# EAGLE design PiHatTeensy32 (EAGLE 9.6.0)
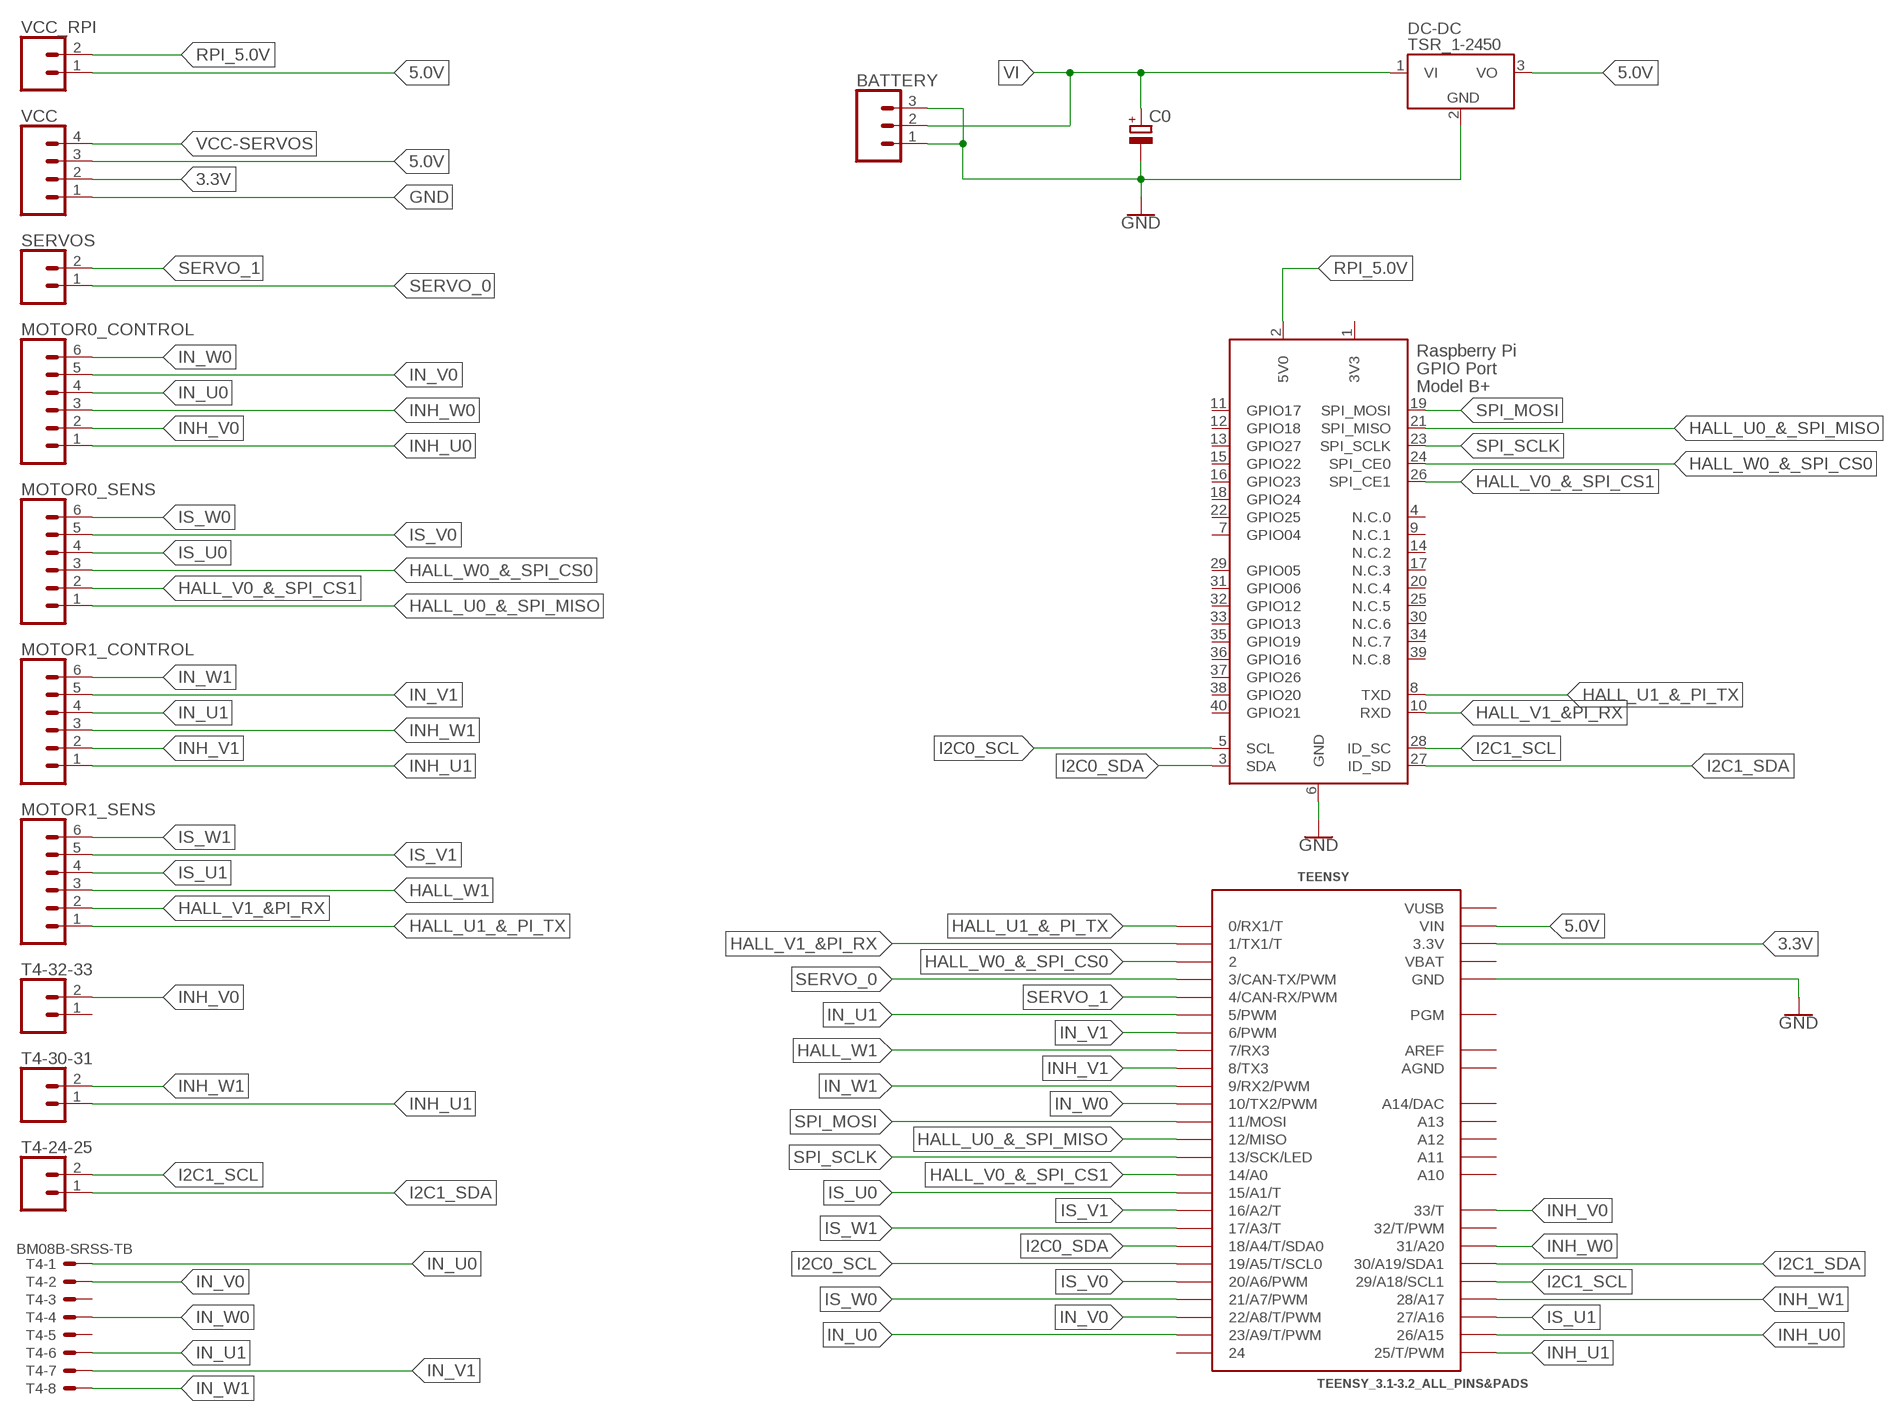
[diagram p0: schematic, sheet 1]

## Parts
BATTERY  CONN_031X03_NO_SILK  [1X03_NO_SILK]
C0  CPOL-EUE2,5-6E  [E2,5-6E]
DC-DC  TSR_1-2450  [TSR-1]
MOTOR0_CONTROL  CONN_06NO_SILK_NO_POP  [1X06_NO_SILK]
MOTOR0_SENS  CONN_06NO_SILK_NO_POP  [1X06_NO_SILK]
MOTOR1_CONTROL  CONN_06NO_SILK_NO_POP  [1X06_NO_SILK]
MOTOR1_SENS  CONN_06NO_SILK_NO_POP  [1X06_NO_SILK]
SERVOS  CONN_021X02_NO_SILK  [1X02_NO_SILK]
T4  BM08B-SRSS-TB  [BM08B-SRSS-TB]
T4-24-25  CONN_021X02_NO_SILK  [1X02_NO_SILK]
T4-30-31  CONN_021X02_NO_SILK  [1X02_NO_SILK]
T4-32-33  CONN_021X02_NO_SILK  [1X02_NO_SILK]
TEENSY  TEENSY_3.1-3.2_ALL_PINS&PADS  [TEENSY_3.0-3.2_ALL_PINS_&_PADS]
VCC  CONN_041X04_NO_SILK  [1X04_NO_SILK]
VCC_RPI  CONN_021X02_NO_SILK  [1X02_NO_SILK]
X1  RASPI_BOARD_B+_H  [RASPI_BOARD_B+HAT]

## Nets
3.3V: TEENSY.3.3V TEENSY.3.3V1(3.3V) TEENSY.3.3V2(3.3V) VCC.2
5.0V: DC-DC.3(VO) TEENSY.VIN VCC.3 VCC_RPI.1
GND: BATTERY.1 BATTERY.3 C0.- DC-DC.2(GND) TEENSY.GND TEENSY.GND1(GND) TEENSY.GND2(GND) VCC.1 X1.6(GND)
HALL_U0_&_SPI_MISO: MOTOR0_SENS.1 TEENSY.12(12/MISO) X1.21(SPI_MISO)
HALL_U1_&_PI_TX: MOTOR1_SENS.1 TEENSY.0(0/RX1/T) X1.8(TXD)
HALL_V0_&_SPI_CS1: MOTOR0_SENS.2 TEENSY.14/A0 X1.26(SPI_CE1)
HALL_V1_&PI_RX: MOTOR1_SENS.2 TEENSY.1(1/TX1/T) X1.10(RXD)
HALL_W0_&_SPI_CS0: MOTOR0_SENS.3 TEENSY.2 X1.24(SPI_CE0)
HALL_W1: MOTOR1_SENS.3 TEENSY.7(7/RX3)
I2C0_SCL: TEENSY.19/A5(19/A5/T/SCL0) X1.5(SCL)
I2C0_SDA: TEENSY.18/A4(18/A4/T/SDA0) X1.3(SDA)
I2C1_SCL: T4-24-25.2 TEENSY.29(29/A18/SCL1) X1.28(ID_SC)
I2C1_SDA: T4-24-25.1 TEENSY.30(30/A19/SDA1) X1.27(ID_SD)
IN_U0: MOTOR0_CONTROL.4 T4.1 TEENSY.23/A9(23/A9/T/PWM)
IN_U1: MOTOR1_CONTROL.4 T4.6 TEENSY.5(5/PWM)
IN_V0: MOTOR0_CONTROL.5 T4.2 TEENSY.22/A8(22/A8/T/PWM)
IN_V1: MOTOR1_CONTROL.5 T4.7 TEENSY.6(6/PWM)
IN_W0: MOTOR0_CONTROL.6 T4.4 TEENSY.10(10/TX2/PWM)
IN_W1: MOTOR1_CONTROL.6 T4.8 TEENSY.9(9/RX2/PWM)
INH_U0: MOTOR0_CONTROL.1 TEENSY.26(26/A15)
INH_U1: MOTOR1_CONTROL.1 T4-30-31.1 TEENSY.25(25/T/PWM)
INH_V0: MOTOR0_CONTROL.2 T4-32-33.2 TEENSY.33(33/T)
INH_V1: MOTOR1_CONTROL.2 TEENSY.8(8/TX3)
INH_W0: MOTOR0_CONTROL.3 TEENSY.31(31/A20)
INH_W1: MOTOR1_CONTROL.3 T4-30-31.2 TEENSY.28(28/A17)
IS_U0: MOTOR0_SENS.4 TEENSY.15/A1(15/A1/T)
IS_U1: MOTOR1_SENS.4 TEENSY.27(27/A16)
IS_V0: MOTOR0_SENS.5 TEENSY.20/A6(20/A6/PWM)
IS_V1: MOTOR1_SENS.5 TEENSY.16/A2(16/A2/T)
IS_W0: MOTOR0_SENS.6 TEENSY.21/A7(21/A7/PWM)
IS_W1: MOTOR1_SENS.6 TEENSY.17/A3(17/A3/T)
RPI_5.0V: VCC_RPI.2 X1.2(5V0)
SERVO_0: SERVOS.1 TEENSY.3(3/CAN-TX/PWM)
SERVO_1: SERVOS.2 TEENSY.4(4/CAN-RX/PWM)
SPI_MOSI: TEENSY.11(11/MOSI) X1.19(SPI_MOSI)
SPI_SCLK: TEENSY.13(13/SCK/LED) X1.23(SPI_SCLK)
VCC-SERVOS: VCC.4
VI: BATTERY.2 C0.+ DC-DC.1(VI)
Unconnected: T4-32-33.1 T4.3 T4.5 TEENSY.24 TEENSY.32(32/T/PWM) TEENSY.A10 TEENSY.A11 TEENSY.A12 TEENSY.A13 TEENSY.PGM TEENSY.RESET/DAC(A14/DAC) X1.4(N.C.0) X1.7(GPIO04) X1.9(N.C.1) X1.11(GPIO17) X1.12(GPIO18) X1.13(GPIO27) X1.14(N.C.2) X1.15(GPIO22) X1.16(GPIO23) X1.17(N.C.3) X1.18(GPIO24) X1.20(N.C.4) X1.22(GPIO25) X1.25(N.C.5) X1.29(GPIO05) X1.30(N.C.6) X1.31(GPIO06) X1.32(GPIO12) X1.33(GPIO13) X1.34(N.C.7) X1.35(GPIO19) X1.36(GPIO16) X1.37(GPIO26) X1.38(GPIO20) X1.39(N.C.8) X1.40(GPIO21)

## Power pins joined to a net without a drawn wire
3V3: X1.1(3V3)
AGND: TEENSY.AGND
AREF: TEENSY.AREF
VBAT: TEENSY.VBAT
VUSB: TEENSY.VUSB

## Library data of the parts
BATTERY = SparkFun-Connectors:CONN_03: Multi connection point. Often used as Generic Header-pin footprint for 0.1 inch spaced/style header connections On any of the 0.1 inch spaced packages, you can populate with these: Break Away Headers - Straight <https://www.sparkfun.com/products/116> (PRT-00116) Break Away Male Headers - Right Angle <https://www.sparkfun.com/products/553> (PRT-00553) Female Headers <https://www.sparkfun.com/products/115> (PRT-00115) Break Away Headers - Machine Pin <https://www.sparkfun.com/products/117> (PRT-00117) Break Away Female Headers - Swiss Machine Pin <https://www.sparkfun.com/products/743> (PRT-00743) Stackable Header - 3 Pin (Female, 0.1") <https://www.sparkfun.com/products/13875> (PRT-13875) For SCREWTERMINALS and SPRING TERMINALS visit here: Screw Terimnals on SparkFun.com <https://www.sparkfun.com/search/results?term=Screw+Terminals> (5mm/3.5mm/2.54mm spacing) This device is also useful as a general connection point to wire up your design to another part of your project. Our various solder wires solder well into these plated through hole pads. Hook-Up Wire - Assortment (Stranded, 22 AWG) <https://www.sparkfun.com/products/11375> (PRT-11375) Hook-Up Wire - Assortment (Solid Core, 22 AWG) <https://www.sparkfun.com/products/11367> (PRT-11367) View the entire wire category on our website here <https://www.sparkfun.com/categories/141> Special notes: Molex polarized connector foot print use with SKU : PRT-08232 with associated crimp pins and housings.
C0 = rcl:CPOL-EU: POLARIZED CAPACITOR, European symbol; SPICEPREFIX: C
DC-DC = _traco_tsr-1:TSR_1-*: TRACO TSR-1 Series Point-of-Load DC/DC-Converters Vi max. 36 V; Vo = (1.2 .. 15)V ±2%; Io = 0 .. 1 A SIP-Package (drop-in replacement for 78xx linear voltage regulators in TO220-package, vertically assembled) Source: www.tracopower.com Technologies: TSR 1- Vi (V) Vo (V) ±2% Io = 0 .. 1 A 24_ ( generic ) 2412 4.6 .. 36 1.2 2415 4.6 .. 36 1.5 2418 4.6 .. 36 1.8 2425 4.6 .. 36 2.5 2433 4.75.. 36 3.3 2450 6.5 .. 36 5.0 2465 9.0 .. 36 6.5 2490 12 .. 36 9.0 24120 15 .. 36 12 24150 18 .. 36 15 Author: Dipl.-Ing. FH Rainer Bayer HHN Hochschule Heilbronn, rainer.bayer@hs-heilbronn.de Ingenieurbüro ing-rb, mail@ing-rb.de
MOTOR0_CONTROL MOTOR0_SENS MOTOR1_CONTROL MOTOR1_SENS = SparkFun-Connectors:CONN_06: Multi connection point. Often used as Generic Header-pin footprint for 0.1 inch spaced/style header connections On any of the 0.1 inch spaced packages, you can populate with these: Break Away Headers - Straight <https://www.sparkfun.com/products/116> (PRT-00116) Break Away Male Headers - Right Angle <https://www.sparkfun.com/products/553> (PRT-00553) Female Headers <https://www.sparkfun.com/products/115> (PRT-00115) Break Away Headers - Machine Pin <https://www.sparkfun.com/products/117> (PRT-00117) Break Away Female Headers - Swiss Machine Pin <https://www.sparkfun.com/products/743> (PRT-00743) Arduino Stackable Header - 6 Pin <https://www.sparkfun.com/products/9280> (PRT-09280) For SCREWTERMINALS and SPRING TERMINALS visit here: Screw Terimnals on SparkFun.com <https://www.sparkfun.com/search/results?term=Screw+Terminals> (5mm/3.5mm/2.54mm spacing) This device is also useful as a general connection point to wire up your design to another part of your project. Our various solder wires solder well into these plated through hole pads. Hook-Up Wire - Assortment (Stranded, 22 AWG) <https://www.sparkfun.com/products/11375> (PRT-11375) Hook-Up Wire - Assortment (Solid Core, 22 AWG) <https://www.sparkfun.com/products/11367> (PRT-11367) View the entire wire category on our website here <https://www.sparkfun.com/categories/141>
SERVOS T4-24-25 T4-30-31 T4-32-33 VCC_RPI = SparkFun-Connectors:CONN_02: Multi connection point. Often used as Generic Header-pin footprint for 0.1 inch spaced/style header connections On any of the 0.1 inch spaced packages, you can populate with these: Break Away Headers - Straight <https://www.sparkfun.com/products/116> (PRT-00116) Break Away Male Headers - Right Angle <https://www.sparkfun.com/products/553> (PRT-00553) Female Headers <https://www.sparkfun.com/products/115> (PRT-00115) Break Away Headers - Machine Pin <https://www.sparkfun.com/products/117> (PRT-00117) Break Away Female Headers - Swiss Machine Pin <https://www.sparkfun.com/products/743> (PRT-00743) For SCREWTERMINALS and SPRING TERMINALS visit here: Screw Terimnals on SparkFun.com <https://www.sparkfun.com/search/results?term=Screw+Terminals> (5mm/3.5mm/2.54mm spacing) This device is also useful as a general connection point to wire up your design to another part of your project. Our various solder wires solder well into these plated through hole pads. Hook-Up Wire - Assortment (Stranded, 22 AWG) <https://www.sparkfun.com/products/11375> (PRT-11375) Hook-Up Wire - Assortment (Solid Core, 22 AWG) <https://www.sparkfun.com/products/11367> (PRT-11367) View the entire wire category on our website here <https://www.sparkfun.com/categories/141> Special notes: Molex polarized connector foot print use with: PRT-08233 with associated crimp pins and housings. 2.54_SCREWTERM for use with PRT-10571. 3.5mm Screw Terminal footprints for PRT-08084 5mm Screw Terminal footprints for use with PRT-08432
T4 = con-jst2:?M08B-SRSS-TB: Disconnectable Crimp style connector, 1.0mm pitch 8 contacts
TEENSY = Teensy_3_and_LC_Series_Boards_v1.4:TEENSY_3.1-3.2_ALL_PINS&PADS: Footprint for Teensy 3.1 or 3.2 board using all pads and all through-holes. Pads need a 2x7 0.1" SMD header.
VCC = SparkFun-Connectors:CONN_04: Multi connection point. Often used as Generic Header-pin footprint for 0.1 inch spaced/style header connections On any of the 0.1 inch spaced packages, you can populate with these: Break Away Headers - Straight <https://www.sparkfun.com/products/116> (PRT-00116) Break Away Male Headers - Right Angle <https://www.sparkfun.com/products/553> (PRT-00553) Female Headers <https://www.sparkfun.com/products/115> (PRT-00115) Break Away Headers - Machine Pin <https://www.sparkfun.com/products/117> (PRT-00117) Break Away Female Headers - Swiss Machine Pin <https://www.sparkfun.com/products/743> (PRT-00743) For SCREWTERMINALS and SPRING TERMINALS visit here: Screw Terimnals on SparkFun.com <https://www.sparkfun.com/search/results?term=Screw+Terminals> (5mm/3.5mm/2.54mm spacing) This device is also useful as a general connection point to wire up your design to another part of your project. Our various solder wires solder well into these plated through hole pads. Hook-Up Wire - Assortment (Stranded, 22 AWG) <https://www.sparkfun.com/products/11375> (PRT-11375) Hook-Up Wire - Assortment (Solid Core, 22 AWG) <https://www.sparkfun.com/products/11367> (PRT-11367) View the entire wire category on our website here <https://www.sparkfun.com/categories/141> Special notes: Molex polarized connector foot print use with SKU : PRT-08231 with associated crimp pins and housings. 1MM SMD Version SKU: PRT-10208; PROD_ID: CONN-09696
X1 = raspberrypi_bastelstube_v13:RASPI_BOARD_B+: Raspberry Pi GPIO connector with markings for the outer dimensions of the Raspberry Pi board model B+ with different sets of drill holes or mounting pads

## Net classes
0 default: width 0.305 mm

## Board
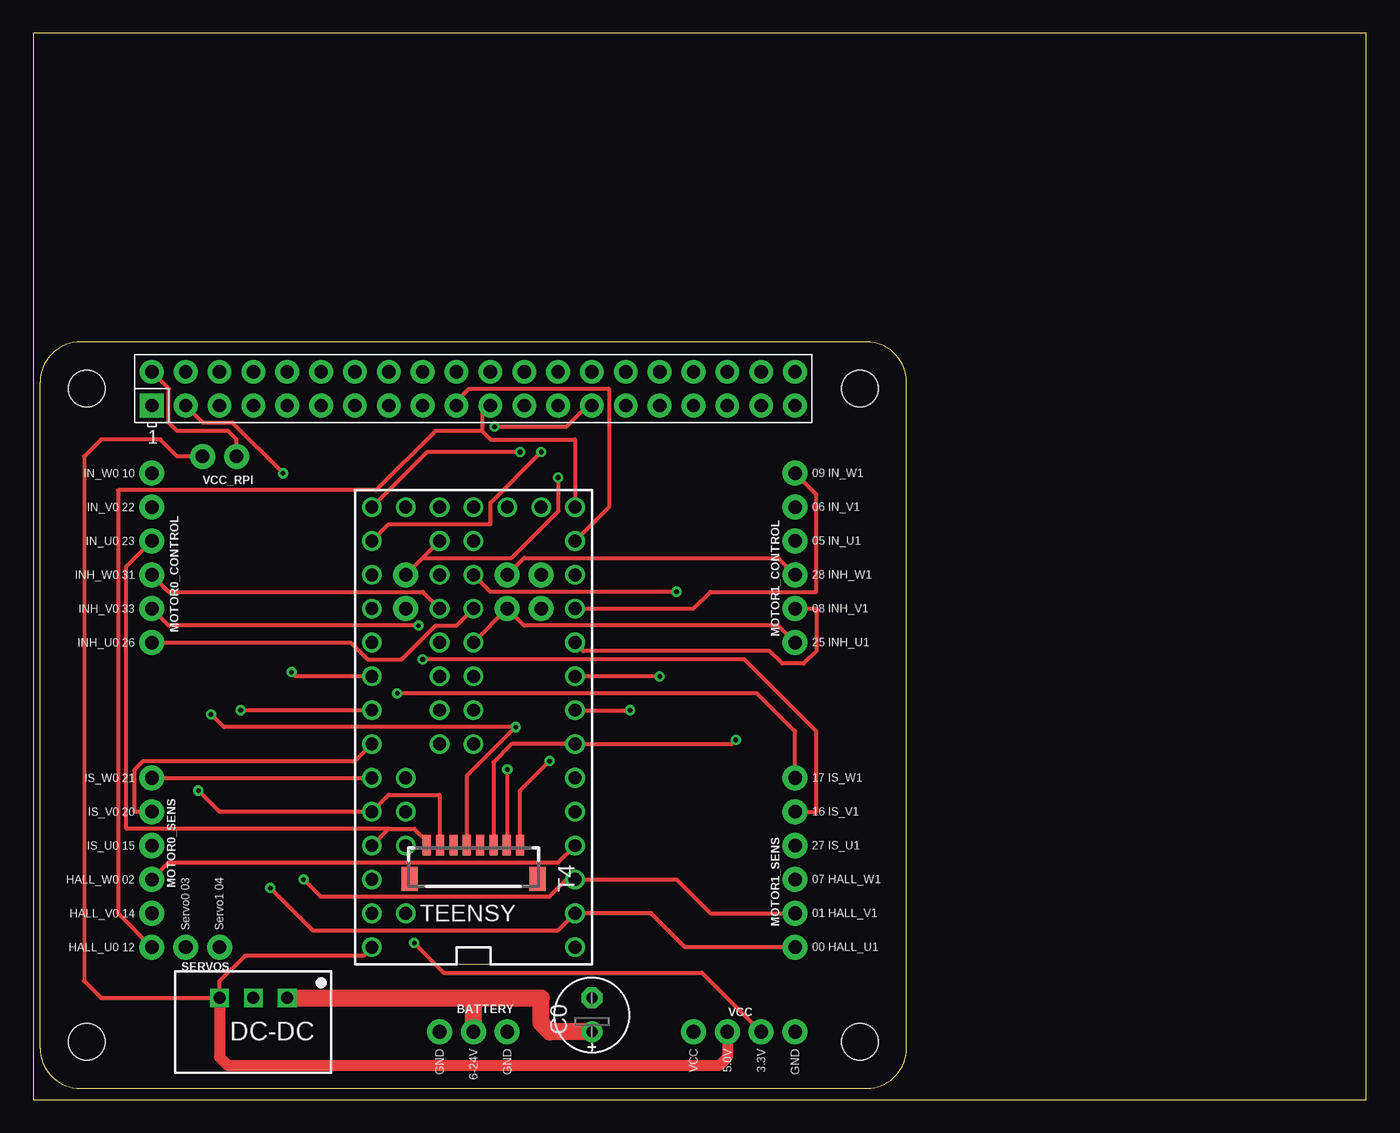
[diagram p1: board, top side]
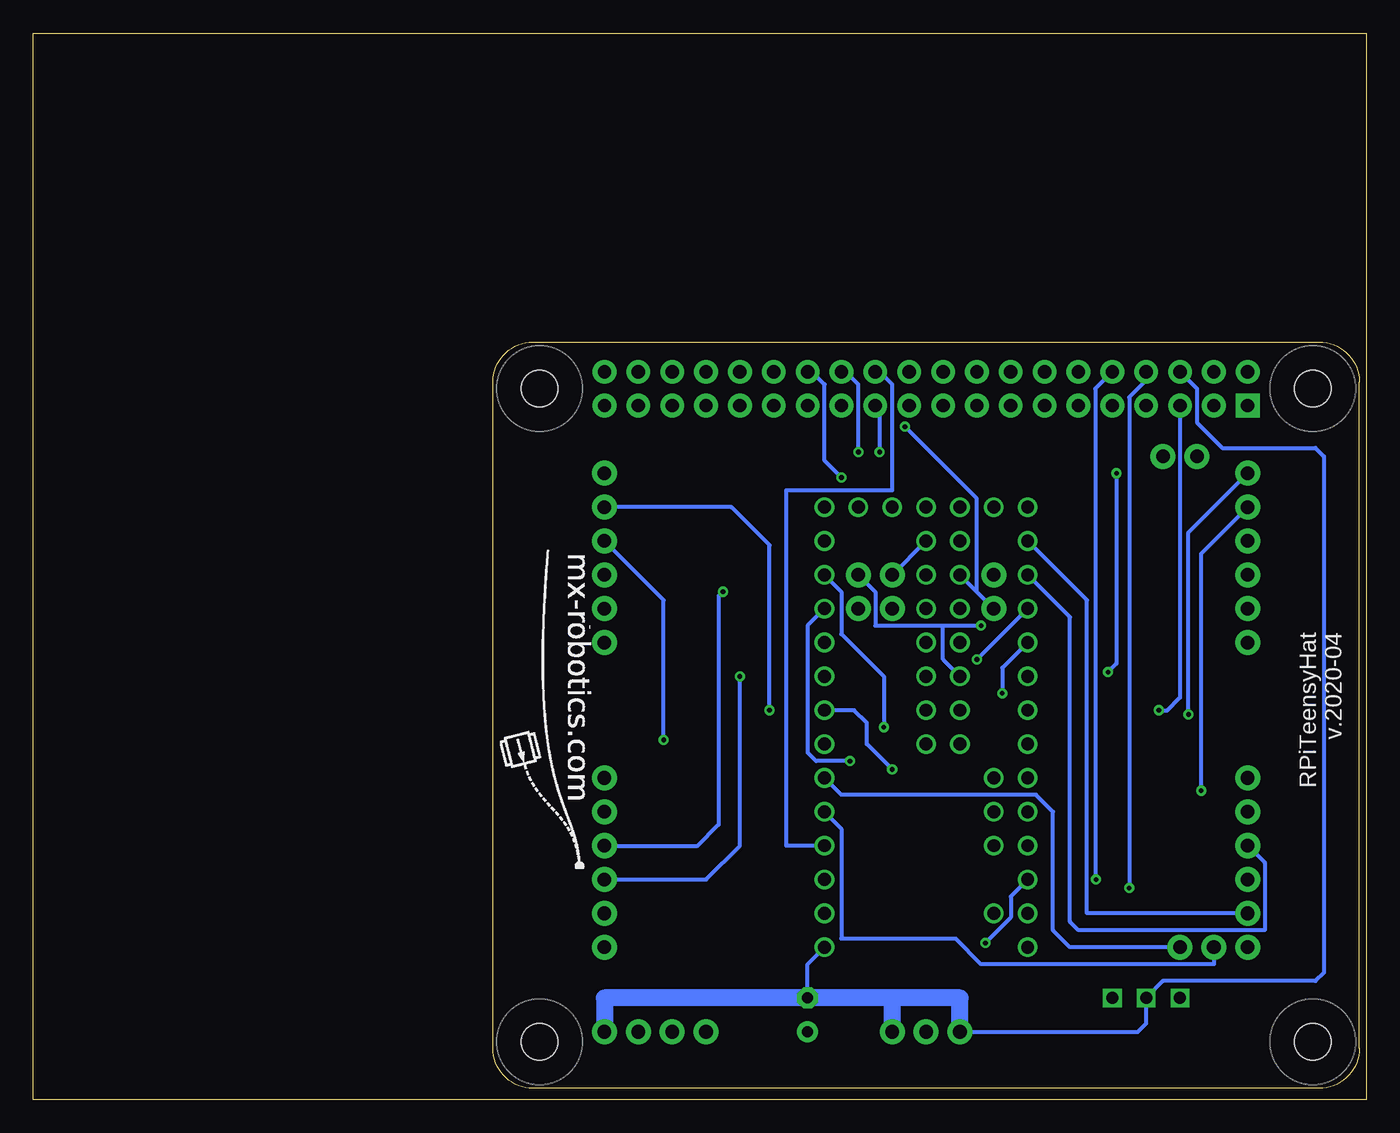
[diagram p2: board, bottom side, seen from below]

Size 100 x 80 mm. Coordinates in mm from the lower left corner, seen from the top.
Outline: 0,0 100,0 100,80 0,80 0,0
Copper layers (1*16): Top 0.035mm / dielectric 1.5mm / Bottom 0.035mm
Design rules "default": minimum track width 6mil, minimum drill 0.35mm, track to track 6mil, track to pad 6mil, pad to pad 6mil, via to via 6mil, smd to smd 6mil, copper to edge 40mil, drill to drill 6mil, minimum pad ring 10mil, minimum via ring 8mil, stop-mask expansion 4mil, vias tented up to drill 0mil, thermal gap 10mil

### Footprints (pad centres in the part's own frame; a part is rotated, then mirrored left to right if it is on the bottom)
1X03_NO_SILK = drill 1.016 pad 1.88: 1 0,0; 2 2.54,0; 3 5.08,0
E2,5-6E = drill 0.813 pad 1.575: + -1.27,0 | drill 0.813 pad 1.575 octagon: - 1.27,0
TSR-1 = drill 0.9 square: 1 -2.54,0; 2 0,0; 3 2.54,0
1X06_NO_SILK = drill 1.016 pad 1.88: 1 0,0; 2 2.54,0; 3 5.08,0; 4 7.62,0; 5 10.16,0; 6 12.7,0
1X02_NO_SILK = drill 1.016 pad 1.88: 1 0,0; 2 2.54,0
BM08B-SRSS-TB = smd 0.6 x 1.55: 1 3.5,-1.625; 2 2.5,-1.625; 3 1.5,-1.625; 4 0.5,-1.625; 5 -0.5,-1.625; 6 -1.5,-1.625; 7 -2.5,-1.625; 8 -3.5,-1.625 | smd 1.2 x 1.8: FIT@1 4.8,0.9; FIT@2 -4.8,0.9
TEENSY_3.0-3.2_ALL_PINS_&_PADS = drill 0.965: 0 -7.62,13.97; 1 -7.62,11.43; 2 -7.62,8.89; 3 -7.62,6.35; 3.3V 7.62,11.43; 3.3V1 -2.54,-16.51; 3.3V2 2.54,-1.27; 4 -7.62,3.81; 5 -7.62,1.27; 6 -7.62,-1.27; 7 -7.62,-3.81; 8 -7.62,-6.35; 9 -7.62,-8.89; 10 -7.62,-11.43; 11 -7.62,-13.97; 12 -7.62,-16.51; 13 7.62,-16.51; 14/A0 7.62,-13.97; 15/A1 7.62,-11.43; 16/A2 7.62,-8.89; 17/A3 7.62,-6.35; 18/A4 7.62,-3.81; 19/A5 7.62,-1.27; 20/A6 7.62,1.27; 21/A7 7.62,3.81; 22/A8 7.62,6.35; 23/A9 7.62,8.89; 24 0,-3.81; 25 0,-6.35; 26 0,-8.89; 27 0,-11.43; 28 0,-13.97; 29 2.54,-13.97; 30 2.54,-11.43; 31 2.54,-8.89; 32 2.54,-6.35; 33 2.54,-3.81; A10 5.08,6.35; A11 5.08,3.81; A12 0,1.27; A13 2.54,1.27; AGND 7.62,13.97; AREF 5.08,8.89; GND -7.62,16.51; GND1 0,-16.51; GND2 0,-1.27; PGM 2.54,-16.51; RESET/DAC 5.08,-16.51; VBAT -5.08,-16.51; VIN 7.62,16.51; VUSB 5.08,13.97
1X04_NO_SILK = drill 1.016 pad 1.88: 1 0,0; 2 2.54,0; 3 5.08,0; 4 7.62,0
RASPI_BOARD_B+HAT = drill 1 pad 1.778 square: 1 8.37,51.23 | drill 1 pad 1.778: 2 8.37,53.77; 3 10.91,51.23; 4 10.91,53.77; 5 13.45,51.23; 6 13.45,53.77; 7 15.99,51.23; 8 15.99,53.77; 9 18.53,51.23; 10 18.53,53.77; 11 21.07,51.23; 12 21.07,53.77; 13 23.61,51.23; 14 23.61,53.77; 15 26.15,51.23; 16 26.15,53.77; 17 28.69,51.23; 18 28.69,53.77; 19 31.23,51.23; 20 31.23,53.77; 21 33.77,51.23; 22 33.77,53.77; 23 36.31,51.23; 24 36.31,53.77; 25 38.85,51.23; 26 38.85,53.77; 27 41.39,51.23; 28 41.39,53.77; 29 43.93,51.23; 30 43.93,53.77; 31 46.47,51.23; 32 46.47,53.77; 33 49.01,51.23; 34 49.01,53.77; 35 51.55,51.23; 36 51.55,53.77; 37 54.09,51.23; 38 54.09,53.77; 39 56.63,51.23; 40 56.63,53.77 | hole 2.75: 3.5,3.5; 3.5,52.5; 61.5,3.5; 61.5,52.5

### Placement (x,y rotation side)
BATTERY  30.48,5.08 0 top
C0  41.91,6.35 90 top
DC-DC  16.51,7.62 180 top
MOTOR0_CONTROL  8.89,34.29 90 top
MOTOR0_SENS  8.89,11.43 90 top
MOTOR1_CONTROL  57.15,34.29 90 top
MOTOR1_SENS  57.15,11.43 90 top
SERVOS  11.43,11.43 0 top
T4  33.02,17.46 180 top
T4-24-25  27.94,36.83 90 top
T4-30-31  35.56,36.83 90 top
T4-32-33  38.1,36.83 90 top
TEENSY  33.02,27.94 180 top
VCC  57.15,5.08 180 top
VCC_RPI  12.7,48.26 0 top
X1  0.52,0.84 0 top

### Tracks (layer width: path | path; a pad name or v marks a point on that pad's centre or on a via)
3.3V  (via drill 0.35)
  Top 0.152: 54.56,5.18 VCC.2
  Top 0.305: VCC.2 50.16,9.53 30.8,9.53 v28.57,11.75
  Bottom 0.305: v28.57,11.75 26.67,13.65 26.67,15.24 TEENSY.3.3V
5.0V
  Top 0.305: TEENSY.VIN 24.77,10.79 15.88,10.79 13.97,8.89 DC-DC.3 5.08,7.62 3.81,8.89 3.81,48.26 5.08,49.53 9.53,49.53 10.79,48.26 VCC_RPI.1
  Top 0.813: VCC.3 52.07,3.17 51.44,2.54 14.61,2.54 13.97,3.17 DC-DC.3
GND
  Bottom 0.305: 16.59,7.62 DC-DC.2 | X1.6 12.7,53.34 12.7,50.8 10.79,48.9 3.81,48.9 3.17,48.26 3.17,9.53 3.81,8.89 15.24,8.89 DC-DC.2 | DC-DC.2 16.51,5.71 17.14,5.08 BATTERY.1 | C0.- 41.91,10.16 TEENSY.GND
  Bottom 1.27: BATTERY.1 30.48,7.62 35.56,7.62 | 35.56,7.62 C0.- 57.15,7.62 VCC.1 | BATTERY.3 35.56,7.62
HALL_U0_&_SPI_MISO
  Top 0.305: TEENSY.12 40.64,49.53 34.29,49.53 33.66,50.16 | 33.66,50.16 33.66,52.07 33.97,52.07 X1.21 | MOTOR0_SENS.1 6.35,13.97 6.35,45.72 25.72,45.72 30.16,50.16 33.66,50.16
HALL_U1_&_PI_TX  (via drill 0.35)
  Top 0.305: v17.78,15.88 20.95,12.7 39.37,12.7 TEENSY.0 46.35,13.97 48.9,11.43 MOTOR1_SENS.1
  Bottom 0.305: X1.8 16.51,53.98 17.78,52.7 v17.78,15.88
HALL_V0_&_SPI_CS1  (via drill 0.35)
  Top 0.305: v38.1,48.58 34.29,44.77 34.29,43.18 26.67,43.18 TEENSY.14/A0
  Bottom 0.305: TEENSY.14/A0 20.95,37.47 20.95,13.97 MOTOR0_SENS.2 | v38.1,48.58 38.1,53.66 39.05,54.61 X1.26
HALL_V1_&PI_RX  (via drill 0.35)
  Top 0.305: v20.27,16.51 21.54,15.24 38.73,15.24 40.01,16.51 TEENSY.1 48.26,16.51 50.8,13.97 MOTOR1_SENS.2
  Bottom 0.305: X1.10 20.32,53.34 20.32,16.51 v20.27,16.51
HALL_W0_&_SPI_CS0
  Top 0.305: TEENSY.2 39.37,17.78 10.16,17.78 MOTOR0_SENS.3
  Bottom 0.305: TEENSY.2 43.5,19.05 43.5,45.72 35.56,45.72 35.56,53.66 36.51,54.61 X1.24
HALL_W1  (via drill 0.35)
  Top 0.305: v46.99,31.75 TEENSY.7
  Bottom 0.305: MOTOR1_SENS.3 49.53,16.51 46.99,19.05 v46.99,31.75
I2C0_SCL  (via drill 0.35)
  Top 0.305: TEENSY.19/A5 v15.56,29.21
  Bottom 0.305: v15.56,29.21 14.92,29.21 13.97,30.16 X1.5
I2C0_SDA  (via drill 0.35)
  Top 0.305: v19.37,32.07 19.68,31.75 TEENSY.18/A4 | v18.73,46.99 14.92,50.8 12.7,50.8 X1.3
  Bottom 0.305: v19.37,32.07 18.73,32.7 v18.73,46.99
I2C1_SCL  (via drill 0.35)
  Top 0.305: T4-24-25.2 29.21,40.64 | 29.21,40.64 TEENSY.29 | v39.37,46.67 39.37,44.13 35.88,40.64 29.21,40.64
  Bottom 0.305: v39.37,46.67 40.64,47.94 40.64,53.66 41.59,54.61 X1.28
I2C1_SDA  (via drill 0.35)
  Top 0.305: v34.61,50.48 40.01,50.48 41.59,52.07 X1.27
  Bottom 0.305: T4-24-25.1 29.21,38.1 | 29.21,38.1 TEENSY.30 | v34.61,50.48 29.21,45.09 29.21,38.1
IN_U0
  Top 0.305: 26.67,20.32 28.57,20.32 29.53,19.37 T4.1 | TEENSY.23/A9 26.67,20.32 | MOTOR0_CONTROL.4 6.99,40.01 6.99,20.32 26.67,20.32
IN_U1  (via drill 0.35)
  Top 0.305: T4.6 34.52,25.31 35.88,26.67 TEENSY.5 52.39,26.67 v52.7,26.99
  Bottom 0.305: MOTOR1_CONTROL.4 52.7,37.47 v52.7,26.99
IN_V0  (via drill 0.35)
  Top 0.305: T4.2 30.48,19.37 30.48,22.86 26.67,22.86 TEENSY.22/A8 13.97,21.59 v12.38,23.18
  Bottom 0.305: MOTOR0_CONTROL.5 12.38,40.96 v12.38,23.18
IN_V1  (via drill 0.35)
  Top 0.305: v35.56,24.77 35.56,19.37 T4.7 | TEENSY.6 v44.77,29.21
  Bottom 0.305: v35.56,24.77 37.47,26.67 37.47,28.26 38.42,29.21 TEENSY.6 | v44.77,29.21 44.77,41.59 47.62,44.45 MOTOR1_CONTROL.5
IN_W0  (via drill 0.35)
  Top 0.305: T4.4 32.52,24.27 v36.2,27.94 14.29,27.94 v13.34,28.89
  Bottom 0.305: MOTOR0_CONTROL.6 13.34,42.55 v13.34,28.89 | TEENSY.10 39.37,38.1 39.37,34.92 36.2,31.75 v36.2,27.94
IN_W1  (via drill 0.35)
  Top 0.305: MOTOR1_CONTROL.6 58.74,45.4 58.74,38.1 50.8,38.1 49.53,36.83 TEENSY.9 | T4.8 36.52,23.18 v38.73,25.4
  Bottom 0.305: v38.73,25.4 41.27,25.4 41.91,26.04 41.91,35.56 TEENSY.9
INH_U0
  Top 0.305: TEENSY.26 31.75,35.56 30.16,35.56 27.62,33.02 25.08,33.02 23.81,34.29 MOTOR0_CONTROL.1
INH_U1
  Top 0.305: TEENSY.25 T4-30-31.1 36.83,35.56 55.88,35.56 MOTOR1_CONTROL.1
INH_V0  (via drill 0.35)
  Top 0.305: MOTOR0_CONTROL.2 10.16,35.56 v28.89,35.56
  Bottom 0.305: TEENSY.33 31.75,33.02 31.75,35.56 | 31.75,35.56 36.83,35.56 36.83,38.1 T4-32-33.2 | 31.75,35.56 v28.89,35.56
INH_V1
  Top 0.305: TEENSY.8 41.27,33.66 55.24,33.66 56.2,32.7 57.78,32.7 58.74,33.66 58.74,36.83 MOTOR1_CONTROL.2
INH_W0
  Top 0.305: TEENSY.31 29.21,38.1 10.16,38.1 MOTOR0_CONTROL.3
INH_W1
  Top 0.305: MOTOR1_CONTROL.3 55.88,40.64 36.83,40.64 T4-30-31.2
  Bottom 0.305: T4-30-31.2 TEENSY.28
IS_U0
  Bottom 0.305: TEENSY.15/A1 22.23,36.2 22.23,13.34 21.59,12.7 7.62,12.7 7.62,17.78 MOTOR0_SENS.4
IS_U1  (via drill 0.35)
  Top 0.305: TEENSY.27 34.29,38.1 v48.26,38.1
  Bottom 0.305: v48.26,38.1 48.58,37.78 48.58,20.64 50.16,19.05 MOTOR1_SENS.4
IS_V0
  Top 0.305: TEENSY.20/A6 24.13,25.4 8.26,25.4 7.62,24.77 7.62,21.59 MOTOR0_SENS.5
IS_V1  (via drill 0.35)
  Top 0.305: v29.21,33.02 53.34,33.02 58.74,27.62 58.74,21.59 MOTOR1_SENS.5
  Bottom 0.305: v29.21,33.02 TEENSY.16/A2
IS_W0
  Top 0.305: MOTOR0_SENS.6 TEENSY.21/A7
IS_W1  (via drill 0.35)
  Top 0.305: v27.3,30.48 54.29,30.48 57.15,27.62 MOTOR1_SENS.6
  Bottom 0.305: TEENSY.17/A3 27.3,32.38 v27.3,30.48
RPI_5.0V
  Top 0.305: VCC_RPI.2 15.24,49.53 14.61,50.16 10.79,50.16 10.16,50.8 10.16,53.34 X1.2
SERVO_0
  Bottom 0.305: TEENSY.3 39.37,20.32 39.37,12.06 30.8,12.06 28.89,10.16 11.43,10.16 SERVOS.1
SERVO_1
  Bottom 0.152: 14.02,11.43 SERVOS.2
  Bottom 0.305: SERVOS.2 22.23,11.43 23.5,12.7 23.5,21.59 24.77,22.86 39.37,22.86 TEENSY.4
SPI_MOSI
  Top 0.305: TEENSY.11 43.18,44.45 43.18,53.34 32.7,53.34 31.75,52.39 X1.19
SPI_SCLK  (via drill 0.35)
  Top 0.305: TEENSY.13 29.53,48.58 v36.51,48.58
  Bottom 0.305: v36.51,48.58 36.51,52.07 X1.23
VI
  Top 1.27: DC-DC.1 33.02,7.62 | 33.02,7.62 38.1,7.62 38.1,5.71 38.73,5.08 C0.+ | BATTERY.2 33.02,7.62

### Text on the board
tPlace: IN_W0 10 | 09 IN_W1 | 06 IN_V1 | IN_V0 22 | IN_U0 23 | 05 IN_U1 | 28 INH_W1 | INH_W0 31 | INH_V0 33 | 08 INH_V1 | 25 INH_U1 | INH_U0 26 | IS_W0 21 | 17 IS_W1 | 16 IS_V1 | IS_V0 20 | IS_U0 15 | 27 IS_U1 | 07 HALL_W1 | HALL_W0 02 | HALL_V0 14 | 01 HALL_V1 | Servo0 03 | Servo1 04 | 00 HALL_U1 | HALL_U0 12 | GND | 6-24V | GND | VCC | 5.0V | 3.3V | GND
bPlace: RPiTeensyHat / v.2020-04